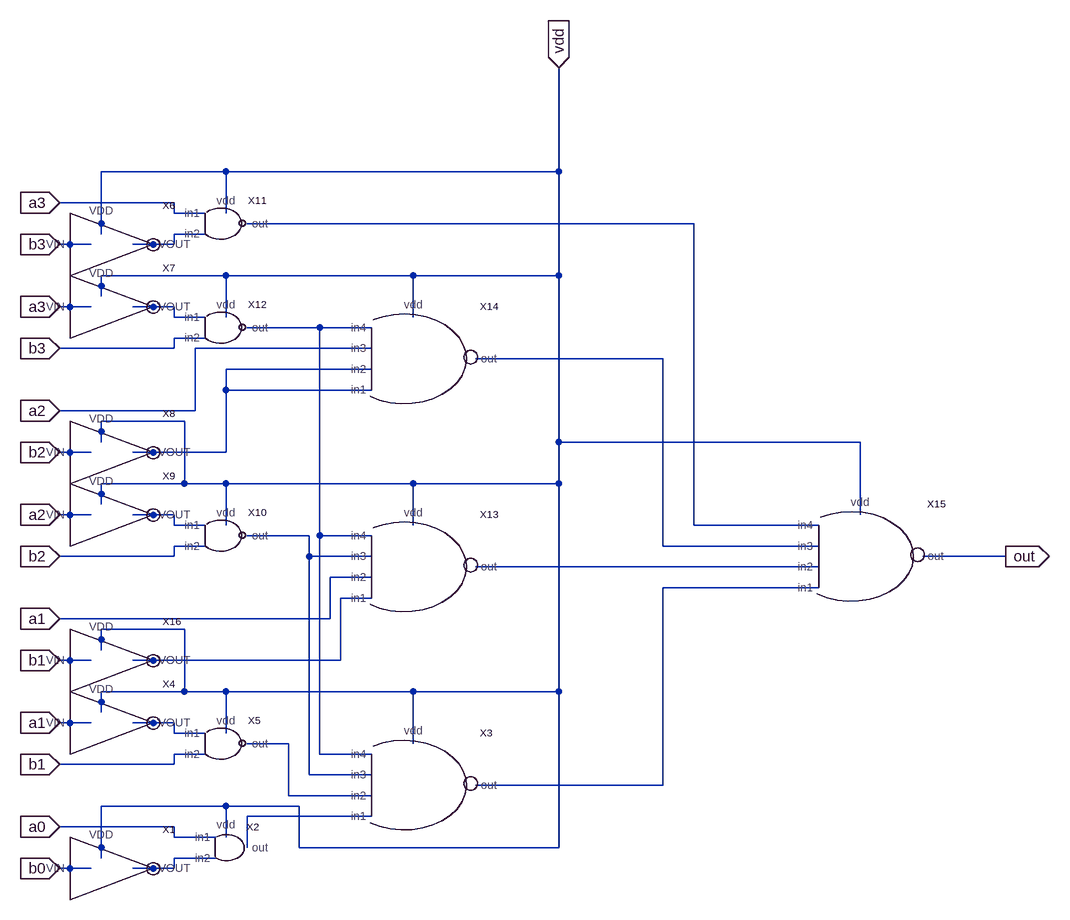
[diagram p0: schematic comparator.asc]
comparator.asc, the LTspice schematic file:
Version 4
SHEET 1 1624 680
WIRE 320 -816 128 -816
WIRE 832 -816 832 -976
WIRE 832 -816 320 -816
WIRE 240 -768 64 -768
WIRE 240 -752 240 -768
WIRE 288 -752 240 -752
WIRE 320 -752 320 -816
WIRE 1040 -736 352 -736
WIRE 128 -720 128 -816
WIRE 288 -720 240 -720
WIRE 112 -704 64 -704
WIRE 240 -704 240 -720
WIRE 240 -704 176 -704
WIRE 320 -656 128 -656
WIRE 608 -656 320 -656
WIRE 832 -656 832 -816
WIRE 832 -656 608 -656
WIRE 128 -624 128 -656
WIRE 112 -608 64 -608
WIRE 240 -608 176 -608
WIRE 240 -592 240 -608
WIRE 288 -592 240 -592
WIRE 320 -592 320 -656
WIRE 608 -592 608 -656
WIRE 464 -576 352 -576
WIRE 544 -576 464 -576
WIRE 288 -560 240 -560
WIRE 240 -544 240 -560
WIRE 240 -544 64 -544
WIRE 544 -544 272 -544
WIRE 992 -528 704 -528
WIRE 544 -512 320 -512
WIRE 320 -480 320 -512
WIRE 544 -480 320 -480
WIRE 272 -448 272 -544
WIRE 272 -448 64 -448
WIRE 256 -432 128 -432
WIRE 128 -400 128 -432
WIRE 832 -400 832 -656
WIRE 1296 -400 832 -400
WIRE 112 -384 64 -384
WIRE 320 -384 320 -480
WIRE 320 -384 176 -384
WIRE 256 -336 256 -432
WIRE 256 -336 128 -336
WIRE 320 -336 256 -336
WIRE 608 -336 320 -336
WIRE 832 -336 832 -400
WIRE 832 -336 608 -336
WIRE 128 -304 128 -336
WIRE 112 -288 64 -288
WIRE 240 -288 176 -288
WIRE 1296 -288 1296 -400
WIRE 240 -272 240 -288
WIRE 288 -272 240 -272
WIRE 320 -272 320 -336
WIRE 608 -272 608 -336
WIRE 1040 -272 1040 -736
WIRE 1232 -272 1040 -272
WIRE 448 -256 352 -256
WIRE 464 -256 464 -576
WIRE 544 -256 464 -256
WIRE 288 -240 240 -240
WIRE 992 -240 992 -528
WIRE 1232 -240 992 -240
WIRE 240 -224 240 -240
WIRE 240 -224 64 -224
WIRE 448 -224 448 -256
WIRE 544 -224 448 -224
WIRE 1520 -224 1392 -224
WIRE 1232 -208 704 -208
WIRE 544 -192 480 -192
WIRE 1232 -176 992 -176
WIRE 544 -160 496 -160
WIRE 480 -128 480 -192
WIRE 480 -128 64 -128
WIRE 256 -112 128 -112
WIRE 128 -80 128 -112
WIRE 112 -64 64 -64
WIRE 496 -64 496 -160
WIRE 496 -64 176 -64
WIRE 256 -16 256 -112
WIRE 256 -16 128 -16
WIRE 320 -16 256 -16
WIRE 608 -16 320 -16
WIRE 832 -16 832 -336
WIRE 832 -16 608 -16
WIRE 128 16 128 -16
WIRE 112 32 64 32
WIRE 240 32 176 32
WIRE 240 48 240 32
WIRE 288 48 240 48
WIRE 320 48 320 -16
WIRE 416 64 352 64
WIRE 608 64 608 -16
WIRE 288 80 240 80
WIRE 464 80 464 -256
WIRE 544 80 464 80
WIRE 240 96 240 80
WIRE 240 96 64 96
WIRE 448 112 448 -224
WIRE 544 112 448 112
WIRE 992 128 992 -176
WIRE 992 128 704 128
WIRE 416 144 416 64
WIRE 544 144 416 144
WIRE 320 160 128 160
WIRE 432 160 320 160
WIRE 544 176 352 176
WIRE 240 192 64 192
WIRE 240 208 240 192
WIRE 304 208 240 208
WIRE 320 208 320 160
WIRE 352 224 352 176
WIRE 432 224 432 160
WIRE 832 224 832 -16
WIRE 832 224 432 224
WIRE 128 240 128 160
WIRE 304 240 240 240
WIRE 112 256 64 256
WIRE 240 256 240 240
WIRE 240 256 176 256
FLAG 64 192 a0
IOPIN 64 192 In
FLAG 64 256 b0
IOPIN 64 256 In
FLAG 64 96 b1
IOPIN 64 96 In
FLAG 64 32 a1
IOPIN 64 32 In
FLAG 64 -64 b1
IOPIN 64 -64 In
FLAG 64 -128 a1
IOPIN 64 -128 In
FLAG 64 -224 b2
IOPIN 64 -224 In
FLAG 64 -288 a2
IOPIN 64 -288 In
FLAG 64 -384 b2
IOPIN 64 -384 In
FLAG 64 -448 a2
IOPIN 64 -448 In
FLAG 64 -544 b3
IOPIN 64 -544 In
FLAG 64 -608 a3
IOPIN 64 -608 In
FLAG 64 -704 b3
IOPIN 64 -704 In
FLAG 64 -768 a3
IOPIN 64 -768 In
FLAG 1520 -224 out
IOPIN 1520 -224 Out
FLAG 832 -976 vdd
IOPIN 832 -976 In
SYMBOL inverter 128 256 R0
SYMATTR InstName X1
SYMBOL and 320 224 R0
SYMATTR InstName X2
SYMBOL nand4 576 144 R0
SYMATTR InstName X3
SYMBOL inverter 128 32 R0
SYMATTR InstName X4
SYMBOL nand 304 64 R0
SYMATTR InstName X5
SYMBOL inverter 128 -704 R0
SYMATTR InstName X6
SYMBOL inverter 128 -608 R0
SYMATTR InstName X7
SYMBOL inverter 128 -384 R0
SYMATTR InstName X8
SYMBOL inverter 128 -288 R0
SYMATTR InstName X9
SYMBOL nand 304 -256 R0
SYMATTR InstName X10
SYMBOL nand 304 -736 R0
SYMATTR InstName X11
SYMBOL nand 304 -576 R0
SYMATTR InstName X12
SYMBOL nand4 576 -192 R0
SYMATTR InstName X13
SYMBOL nand4 576 -512 R0
SYMATTR InstName X14
SYMBOL nand4 1264 -208 R0
SYMATTR InstName X15
SYMBOL inverter 128 -64 R0
SYMATTR InstName X16

The netlist it stands for:
* comparator.asc
XX1 vdd N015 b0 inverter  ; pins VDD VOUT VIN
XX2 a0 N015 vdd N014 and  ; pins in1 in2 vdd out
XX3 N014 N013 N008 N004 N010 vdd nand4  ; pins in1 in2 in3 in4 out vdd
XX4 vdd N012 a1 inverter  ; pins VDD VOUT VIN
XX5 N012 b1 N013 vdd nand  ; pins in1 in2 out vdd
XX6 vdd N002 b3 inverter  ; pins VDD VOUT VIN
XX7 vdd N003 a3 inverter  ; pins VDD VOUT VIN
XX8 vdd N006 b2 inverter  ; pins VDD VOUT VIN
XX9 vdd N007 a2 inverter  ; pins VDD VOUT VIN
XX10 N007 b2 N008 vdd nand  ; pins in1 in2 out vdd
XX11 a3 N002 N001 vdd nand  ; pins in1 in2 out vdd
XX12 N003 b3 N004 vdd nand  ; pins in1 in2 out vdd
XX13 N011 a1 N008 N004 N009 vdd nand4  ; pins in1 in2 in3 in4 out vdd
XX14 N006 N006 a2 N004 N005 vdd nand4  ; pins in1 in2 in3 in4 out vdd
XX15 N010 N009 N005 N001 out vdd nand4  ; pins in1 in2 in3 in4 out vdd
XX16 vdd N011 b1 inverter  ; pins VDD VOUT VIN
.backanno
.end